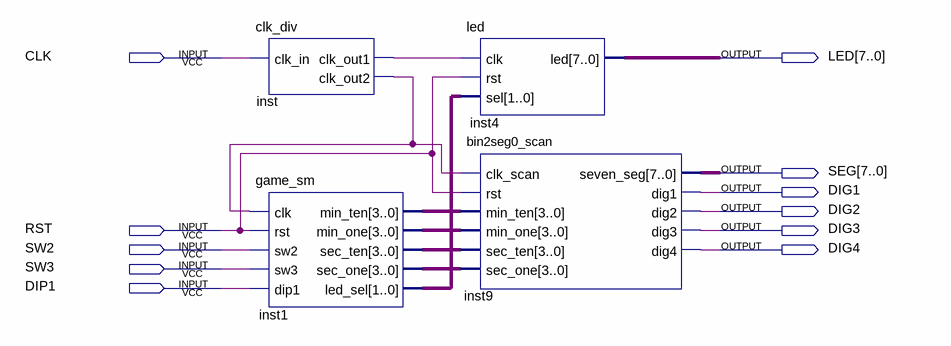
[diagram p0: schematic sheet]
// Quartus schematic game.bdf as structural Verilog: 4 symbols, 11 pins
module game (
  input  CLK,
  input  RST,
  input  SW2,
  input  SW3,
  input  DIP1,
  output [7:0] LED,
  output [7:0] SEG,
  output DIG1,
  output DIG2,
  output DIG3,
  output DIG4
);

  wire inst_clk_out1, inst_clk_out2;
  wire [1:0] inst1_led_sel;
  wire [3:0] inst1_min_one, inst1_min_ten, inst1_sec_one, inst1_sec_ten;

  clk_div inst (.clk_in(CLK), .clk_out1(inst_clk_out1), .clk_out2(inst_clk_out2));
  game_sm inst1 (
    .clk(inst_clk_out2), .rst(RST), .sw2(SW2), .sw3(SW3), .dip1(DIP1), .min_ten(inst1_min_ten),
    .min_one(inst1_min_one), .sec_ten(inst1_sec_ten), .sec_one(inst1_sec_one), .led_sel(inst1_led_sel));
  led inst4 (.clk(inst_clk_out1), .rst(RST), .sel(inst1_led_sel), .led(LED));
  bin2seg0_scan inst9 (
    .clk_scan(inst_clk_out2), .rst(RST), .min_ten(inst1_min_ten), .min_one(inst1_min_one),
    .sec_ten(inst1_sec_ten), .sec_one(inst1_sec_one), .seven_seg(SEG), .dig1(DIG1), .dig2(DIG2), .dig3(DIG3),
    .dig4(DIG4));
endmodule
